# Altium schematic sheet 海关全向本体电路板V3_系统管理.SchDoc
size A4
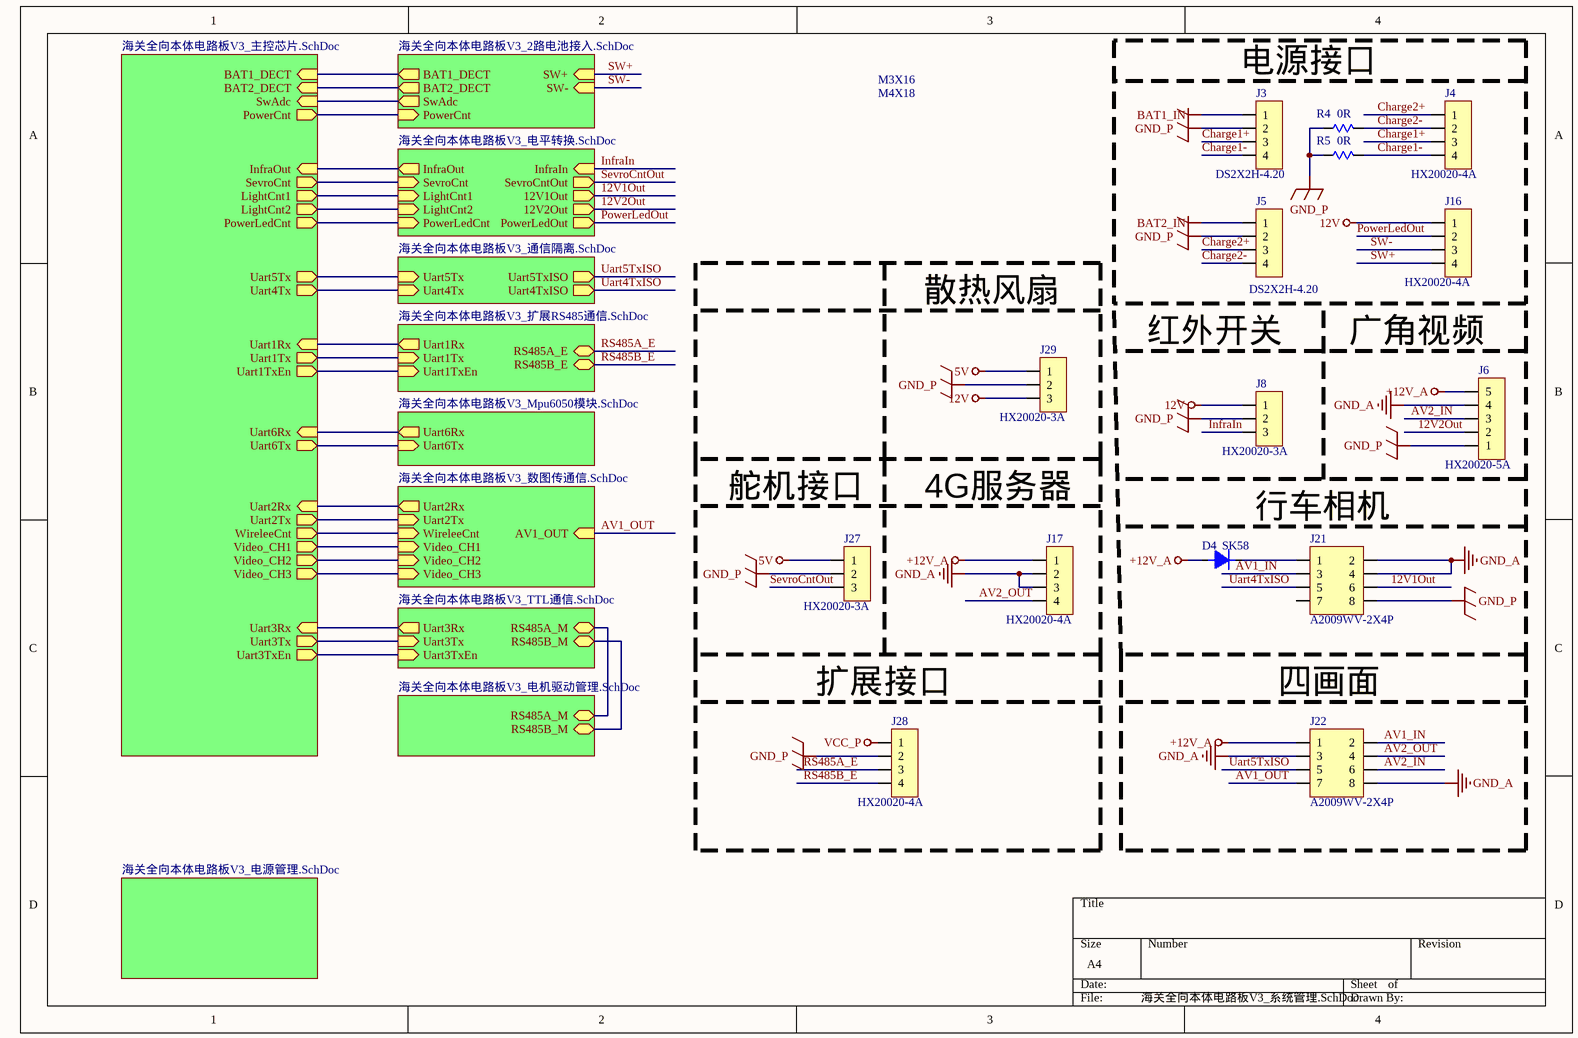
[diagram p0: 海关全向本体电路板V3_系统管理.SchDoc]

## Parts
D4  SK58  [SMB]
J3  DS2X2H-4.20  [5566-04A]
J4  HX20020-4A  [HX20020-4A]
J5  DS2X2H-4.20  [5566-04A]
J6  HX20020-5A  [HX20020-5A]
J8  HX20020-3A  [HX20020-3A]
J16  HX20020-4A  [HX20020-4A]
J17  HX20020-4A  [HX20020-4A]
J21  A2009WV-2X4P  [A2009WV-2X4P]
J22  A2009WV-2X4P  [A2009WV-2X4P]
J27  HX20020-3A  [HX20020-3A]
J28  HX20020-4A  [HX20020-4A]
J29  HX20020-3A  [HX20020-3A]
R4  0R  [R1206-S]
R5  0R  [R1206-S]

## Blocks framed on the sheet
电源接口: J3-J5 J16 R4 R5

## Sub-sheets
? = 海关全向本体电路板V3_电机驱动管理.SchDoc: RS485A_M, RS485B_M
? = 海关全向本体电路板V3_电源管理.SchDoc: no entries
? = 海关全向本体电路板V3_主控芯片.SchDoc: SevroCnt (out), LightCnt1 (out), PowerCnt (out), SwAdc (in), LightCnt2 (out), Uart2Rx (in), Uart2Tx (out), Uart1Tx (out), BAT1_DECT (in), BAT2_DECT (in), PowerLedCnt (out), Uart1Rx (in), Uart4Tx (out), Uart5Tx (out), Uart1TxEn (out), Uart6Tx (out), Uart6Rx (in), Video_CH1 (out), Video_CH2 (out), Video_CH3 (out), WireleeCnt (out), InfraOut (in), Uart3Rx (in), Uart3Tx (out), Uart3TxEn (out)
? = 海关全向本体电路板V3_电平转换.SchDoc: SevroCnt (in), LightCnt1 (in), SevroCntOut (out), 12V1Out (out), LightCnt2 (in), 12V2Out (out), PowerLedCnt (in), PowerLedOut (out), InfraIn (in), InfraOut (out)
? = 海关全向本体电路板V3_TTL通信.SchDoc: RS485A_M, RS485B_M, Uart3Rx (out), Uart3Tx (in), Uart3TxEn (in)
? = 海关全向本体电路板V3_数图传通信.SchDoc: Uart2Rx (out), Uart2Tx (in), Video_CH1 (in), Video_CH2 (in), Video_CH3 (in), WireleeCnt (in), AV1_OUT (in)
? = 海关全向本体电路板V3_扩展RS485通信.SchDoc: Uart1Rx (out), Uart1Tx (in), Uart1TxEn (in), RS485A_E (bidir), RS485B_E (bidir)
? = 海关全向本体电路板V3_2路电池接入.SchDoc: PowerCnt (in), SwAdc (out), SW+ (in), SW- (in), BAT1_DECT (out), BAT2_DECT (out)
? = 海关全向本体电路板V3_通信隔离.SchDoc: Uart5Tx (in), Uart4Tx (in), Uart5TxISO (out), Uart4TxISO (out)
? = 海关全向本体电路板V3_Mpu6050模块.SchDoc: Uart6Rx (out), Uart6Tx (in)

## Nets
5V: J27.1 J29.1
12V: J8.1 J16.1 J29.3
+12V_A: D4.1(A) J6.5 J17.1 J22.1
BAT1_IN: J3.1
BAT2_IN: J5.1
GND_A: J6.4 J17.2 J17.3 J21.2 J21.4 J22.3 J22.8
GND_P: J3.2 J5.2 J6.1 J8.2 J21.8 J27.2 J28.2 J29.2 R4.1 R5.1
VCC_P: J28.1
12V1Out: J21.6 ; sheet /12V1Out
12V2Out: J6.2 ; sheet /12V2Out
AV1_IN: J21.3 J22.2
AV1_OUT: J22.7 ; sheet /AV1_OUT
AV2_IN: J6.3 J22.6
AV2_OUT: J17.4 J22.4
Charge1+: J3.3 J4.3
Charge1-: J3.4 J4.4 R5.2
Charge2+: J4.1 J5.3
Charge2-: J4.2 J5.4 R4.2
InfraIn: J8.3 ; sheet /InfraIn
PowerLedOut: J16.2 ; sheet /PowerLedOut
RS485A_E: J28.3 ; sheet /RS485A_E
RS485B_E: J28.4 ; sheet /RS485B_E
SevroCntOut: J27.3 ; sheet /SevroCntOut
SW+: J16.4 ; sheet /SW+
SW-: J16.3 ; sheet /SW-
Uart4TxISO: J21.5 ; sheet /Uart4TxISO
Uart5TxISO: J22.5 ; sheet /Uart5TxISO
NetD4_2: D4.2(K) J21.1
(unnamed): sheet /RS485A_M, sheet /RS485A_M
(unnamed): sheet /RS485B_M, sheet /RS485B_M
(unnamed): sheet /SevroCnt, sheet /SevroCnt
(unnamed): sheet /LightCnt1, sheet /LightCnt1
(unnamed): sheet /PowerCnt, sheet /PowerCnt
(unnamed): sheet /SwAdc, sheet /SwAdc
(unnamed): sheet /LightCnt2, sheet /LightCnt2
(unnamed): sheet /Uart2Rx, sheet /Uart2Rx
(unnamed): sheet /Uart2Tx, sheet /Uart2Tx
(unnamed): sheet /Uart1Tx, sheet /Uart1Tx
(unnamed): sheet /BAT1_DECT, sheet /BAT1_DECT
(unnamed): sheet /BAT2_DECT, sheet /BAT2_DECT
(unnamed): sheet /PowerLedCnt, sheet /PowerLedCnt
(unnamed): sheet /Uart1Rx, sheet /Uart1Rx
(unnamed): sheet /Uart4Tx, sheet /Uart4Tx
(unnamed): sheet /Uart5Tx, sheet /Uart5Tx
(unnamed): sheet /Uart1TxEn, sheet /Uart1TxEn
(unnamed): sheet /Uart6Tx, sheet /Uart6Tx
(unnamed): sheet /Uart6Rx, sheet /Uart6Rx
(unnamed): sheet /Video_CH1, sheet /Video_CH1
(unnamed): sheet /Video_CH2, sheet /Video_CH2
(unnamed): sheet /Video_CH3, sheet /Video_CH3
(unnamed): sheet /WireleeCnt, sheet /WireleeCnt
(unnamed): sheet /InfraOut, sheet /InfraOut
(unnamed): sheet /Uart3Rx, sheet /Uart3Rx
(unnamed): sheet /Uart3Tx, sheet /Uart3Tx
(unnamed): sheet /Uart3TxEn, sheet /Uart3TxEn

Not connected (* = marked no-connect by the designer): J21 7

## Notes on the sheet
- M3X16
- M4X18
- 散热风扇
- 红外开关
- 广角视频
- 舵机接口
- 4G服务器
- (near J21) 行车相机
- (near J28) 扩展接口
- 四画面

## Library data of the parts
D4 = DIODE1: Diode
J3-J5 J16 J17 J28 = HEADER1X4
J6 = HEADER1X5
J8 J27 J29 = HEADER1X3
J21 J22 = HEADER2X4
R4 R5 = RES: Resistor; Published: 8-Jun-2000; LatestRevisionDate: 17-Jul-2002; LatestRevisionNote: Re-released for DXP Platform.; PackageReference: AXIAL-0.3; Publisher: Altium Limited; Value: 0R